# Altium schematic sheet RS485.SchDoc
size A; SheetNumber: 3; SheetTotal: 9
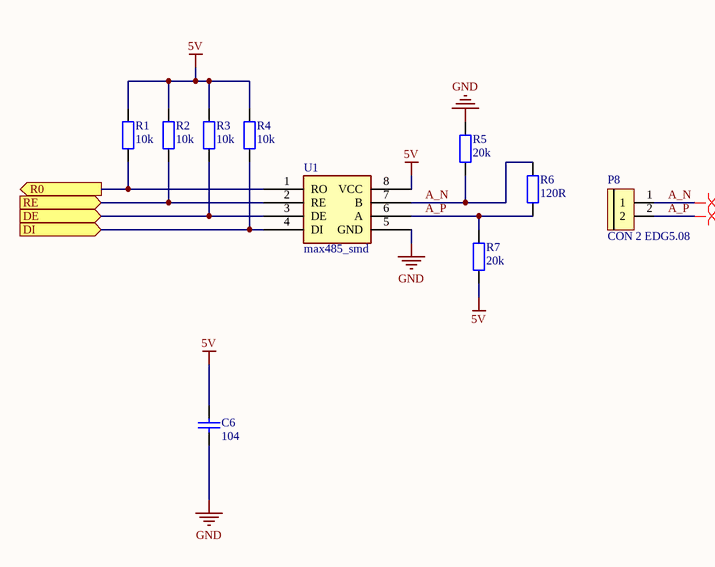
[diagram p0: RS485.SchDoc]

## Parts
C6  104  [tu 0805]
P8  CON 2 EDG5.08  [CON 2 2EDG5.08]
R1  10k  [tro smd 0805]
R2  10k  [tro smd 0805]
R3  10k  [tro smd 0805]
R4  10k  [tro smd 0805]
R5  20k  [tro smd 0805]
R6  120R  [tro smd 0805]
R7  20k  [tro smd 0805]
U1  max485_smd  [SO8W_N]

## Ports
DE (in), DI (in), R0 (out), RE (in)

## Nets
5V: C6.2 R1.2 R2.2 R3.2 R4.2 R7.2 U1.8(VCC)
GND: C6.1 R5.2 U1.5(GND)
A_N: P8.1 R5.1 R6.1 U1.7(B)
A_P: P8.2 R6.2 R7.1 U1.6(A)
DE: R3.1 U1.3(DE) ; port DE
DI: R4.1 U1.4(DI) ; port DI
R0: R1.1 U1.1(RO) ; port R0
RE: R2.1 U1.2(RE) ; port RE

## Layout directives
differential pair: A_N, A_P

## Library data of the parts
C6 = Tu 0805 104 50V 10%: Dán; Don_Vi: Con; So_Chan: 2; Ten_Linh_Kien: Tụ 0805 104-100nF 10% 50V; Ma_Hang: MH004551; Chung_Loai: Dán; Kieu_Chan: *
P8 = CON 2 EDG5.08: Cắm; Ten_Linh_Kien: CON 2 2EDG5.08-2P 5.08MM ( Xanh Cong); Ma_Hang: MH000759; Ghi_Chu: *; Don_Vi: Con; Kieu_Chan: *; Chung_Loai: Cắm
R1-R4 = Tro 0805 1% 10k: Dán; Don_Vi: Con; So_Chan: 2; Ten_Linh_Kien: Trở 0805 1% 10k; Ma_Hang: MH005473; Chung_Loai: Dán; Kieu_Chan: *
R5 R7 = Tro 0805 5% 20k: Dán; Don_Vi: Con; So_Chan: 2; Ten_Linh_Kien: Trở 0805 5% 20k; Ma_Hang: MH005247; Chung_Loai: Dán; Kieu_Chan: *
R6 = Tro 0805 5% 120R: Dán; Don_Vi: Con; So_Chan: 2; Ten_Linh_Kien: Trở 0805 5% 120R; Ma_Hang: MH005253; Chung_Loai: Dán; Kieu_Chan: *